# Altium schematic sheet CW308T_CEC1702.SchDoc: <Enter Sheet Title>
size Letter; Organization: NewAE Technology Inc.; Address1: 1083 Queen St., Suite 196; Address2: Halifax; Address3: NS; Address4: Canada B3H 0B2; SheetApproved: NO
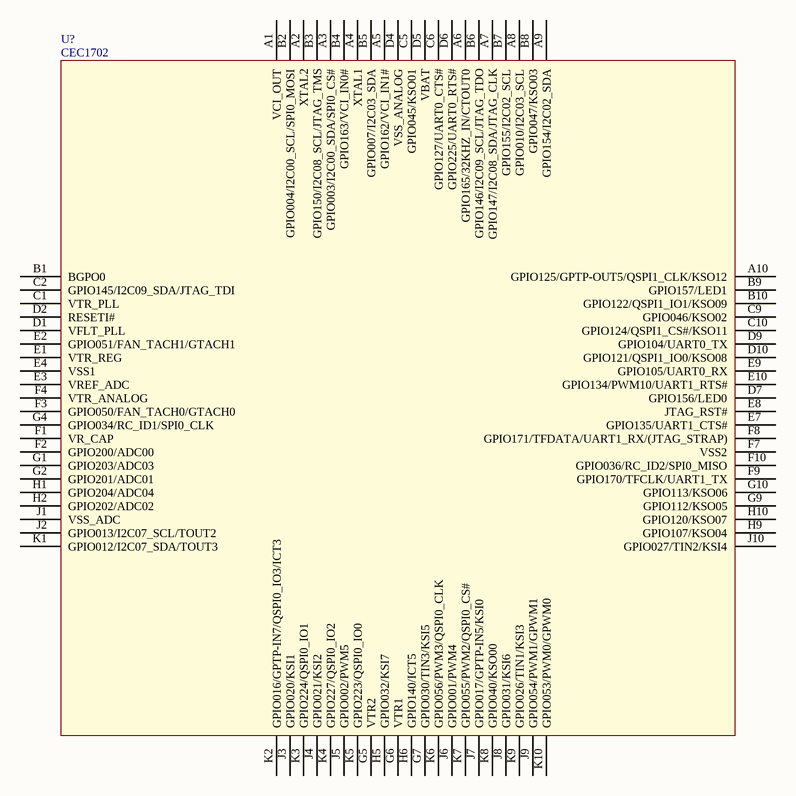
[diagram p0: CW308T_CEC1702.SchDoc]

## Parts
U?  CEC1702  [84L_WFBGA]

## Nets

Not connected (* = marked no-connect by the designer): U? A1(VCI_OUT) A2(XTAL2) A3(GPIO003/I2C00_SDA/SPI0_CS#) A4(XTAL1) A5(GPIO162/VCI_IN1#) A6(GPIO165/32KHZ_IN/CTOUT0) A7(GPIO147/I2C08_SDA/JTAG_CLK) A8(GPIO010/I2C03_SCL) A9(GPIO154/I2C02_SDA) A10(GPIO125/GPTP-OUT5/QSPI1_CLK/KSO12) B1(BGPO0) B2(GPIO004/I2C00_SCL/SPI0_MOSI) B3(GPIO150/I2C08_SCL/JTAG_TMS) B4(GPIO163/VCI_IN0#) B5(GPIO007/I2C03_SDA) B6(GPIO146/I2C09_SCL/JTAG_TDO) B7(GPIO155/I2C02_SCL) B8(GPIO047/KSO03) B9(GPIO157/LED1) B10(GPIO122/QSPI1_IO1/KSO09) C1(VTR_PLL) C2(GPIO145/I2C09_SDA/JTAG_TDI) C5(GPIO045/KSO01) C6(GPIO127/UART0_CTS#) C9(GPIO046/KSO02) C10(GPIO124/QSPI1_CS#/KSO11) D1(VFLT_PLL) D2(RESETI#) D4(VSS_ANALOG) D5(VBAT) D6(GPIO225/UART0_RTS#) D7(GPIO156/LED0) D9(GPIO104/UART0_TX) D10(GPIO121/QSPI1_IO0/KSO08) E1(VTR_REG) E2(GPIO051/FAN_TACH1/GTACH1) E3(VREF_ADC) E4(VSS1) E7(GPIO135/UART1_CTS#) E8(JTAG_RST#) E9(GPIO105/UART0_RX) E10(GPIO134/PWM10/UART1_RTS#) F1(VR_CAP) F2(GPIO200/ADC00) F3(GPIO050/FAN_TACH0/GTACH0) F4(VTR_ANALOG) F7(VSS2) F8(GPIO171/TFDATA/UART1_RX/(JTAG_STRAP)) F9(GPIO170/TFCLK/UART1_TX) F10(GPIO036/RC_ID2/SPI0_MISO) G1(GPIO203/ADC03) G2(GPIO201/ADC01) G4(GPIO034/RC_ID1/SPI0_CLK) G5(VTR2) G6(VTR1) G7(GPIO030/TIN3/KSI5) G9(GPIO112/KSO05) G10(GPIO113/KSO06) H1(GPIO204/ADC04) H2(GPIO202/ADC02) H5(GPIO032/KSI7) H6(GPIO140/ICT5) H9(GPIO107/KSO04) H10(GPIO120/KSO07) J1(VSS_ADC) J2(GPIO013/I2C07_SCL/TOUT2) J3(GPIO020/KSI1) J4(GPIO021/KSI2) J5(GPIO002/PWM5) J6(GPIO001/PWM4) J7(GPIO017/GPTP-IN5/KSI0) J8(GPIO031/KSI6) J9(GPIO054/PWM1/GPWM1) J10(GPIO027/TIN2/KSI4) K1(GPIO012/I2C07_SDA/TOUT3) K2(GPIO016/GPTP-IN7/QSPI0_IO3/ICT3) K3(GPIO224/QSPI0_IO1) K4(GPIO227/QSPI0_IO2) K5(GPIO223/QSPI0_IO0) K6(GPIO056/PWM3/QSPI0_CLK) K7(GPIO055/PWM2/QSPI0_CS#) K8(GPIO040/KSO00) K9(GPIO026/TIN1/KSI3) K10(GPIO053/PWM0/GPWM0)

## Notes on the sheet
- Title:
- Date:
- Rev:
- Time:
- Project:
- Sheet
- of
- License:
- Copyright © NewAE Technology Inc.
- Approved:
- NewAE.com
- File:

## Library data of the parts
U? = CEC1702: CEC1702, 84WFBGA, microchip hardware crypto; Manufacture Part Number 1: CEC1702Q-B1-SX-TR; Component Group: Digital IC; PP Material Stack: 0; Part Number: CEC1702; Manufacture 1: Microchip; Pin Count: 84; Supplier 1: Digi-Key; Supplier Part Number 1: CEC1702Q-B1-SX-CT-ND; ComponentLink1Description: Datasheet; ComponentLink1URL: http://ww1.microchip.com/downloads/en/DeviceDoc/00002207B.pdf; Mounting Technology: SMT; RoHS: Yes; Component Kind: Standard; Component Type: Standard; PP Rotation: 0